# Altium schematic sheet Sheet1.SchDoc
size A4
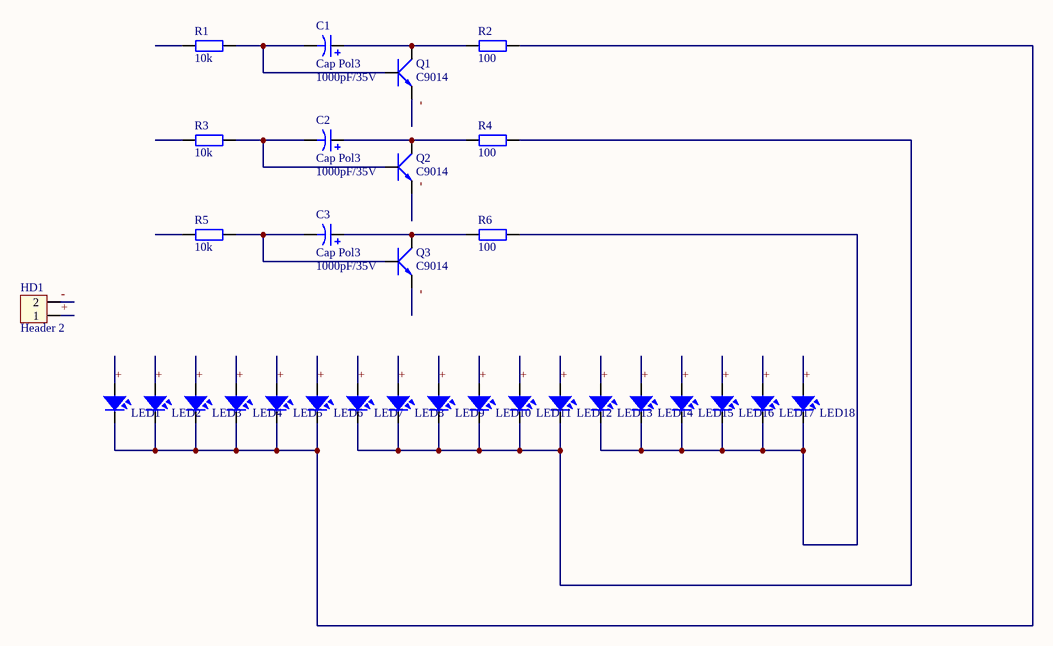
[diagram p0: Sheet1.SchDoc]

## Parts
C1  Cap Pol3  value 1000pF/35V  [CP2/5]
C2  Cap Pol3  value 1000pF/35V  [CP2/5]
C3  Cap Pol3  value 1000pF/35V  [CP2/5]
HD1  Header 2  [HED2B]
LED1  LED  [LED-5-RED]  (value not drawn)
LED2  LED  [LED-5-RED]  (value not drawn)
LED3  LED  [LED-5-RED]  (value not drawn)
LED4  LED  [LED-5-RED]  (value not drawn)
LED5  LED  [LED-5-RED]  (value not drawn)
LED6  LED  [LED-5-RED]  (value not drawn)
LED7  LED  [LED-5-RED]  (value not drawn)
LED8  LED  [LED-5-RED]  (value not drawn)
LED9  LED  [LED-5-RED]  (value not drawn)
LED10  LED  [LED-5-RED]  (value not drawn)
LED11  LED  [LED-5-RED]  (value not drawn)
LED12  LED  [LED-5-RED]  (value not drawn)
LED13  LED  [LED-5-RED]  (value not drawn)
LED14  LED  [LED-5-RED]  (value not drawn)
LED15  LED  [LED-5-RED]  (value not drawn)
LED16  LED  [LED-5-RED]  (value not drawn)
LED17  LED  [LED-5-RED]  (value not drawn)
LED18  LED  [LED-5-RED]  (value not drawn)
Q1  C9014  [QTO-92]
Q2  C9014  [QTO-92]
Q3  C9014  [QTO-92]
R1  10k  [R1/4W]
R2  100  [R1/4W]
R3  10k  [R1/4W]
R4  100  [R1/4W]
R5  10k  [R1/4W]
R6  100  [R1/4W]

## Nets
+: HD1.1 LED1.1 LED2.1 LED3.1 LED4.1 LED5.1 LED6.1 LED7.1 LED8.1 LED9.1 LED10.1 LED11.1 LED12.1 LED13.1 LED14.1 LED15.1 LED16.1 LED17.1 LED18.1
-: HD1.2 Q1.1(E) Q3.1(E)
NetC1_1: C1.1 Q1.3(C) R2.2
NetC1_2: C1.2 Q1.2(B) R1.1
NetC2_1: C2.1 Q2.3(C) R4.2
NetC2_2: C2.2 Q2.2(B) R3.1
NetC3_1: C3.1 Q3.3(C) R6.2
NetC3_2: C3.2 Q3.2(B) R5.1
NetLED1_2: LED1.2 LED2.2 LED3.2 LED4.2 LED5.2 LED6.2 R2.1
NetLED7_2: LED7.2 LED8.2 LED9.2 LED10.2 LED11.2 LED12.2 R4.1
NetLED13_2: LED13.2 LED14.2 LED15.2 LED16.2 LED17.2 LED18.2 R6.1

Not connected (* = marked no-connect by the designer): Q2 1(E); R1 2; R3 2; R5 2

## Notes on the sheet
- Labels drawn without touching a wire or pin: -

## Library data of the parts
C1-C3 = Cap Pol3_1: Polarized Capacitor (Surface Mount); VALUE: C?; LatestRevisionDate: 17-Jul-2002; LatestRevisionNote: Re-released for DXP Platform.; PackageReference: C0805; Publisher: Altium Limited
HD1 = Hed2: Header 2 (Green); Value: Header 2
LED1-LED18 = LED: LED Single colour Green and Red; Value: LED 3 ly Single Colour
Q1-Q3 = C9014: PNP 600mW, EBC; Value: C9014
R1-R6 = R1/4W: Resistor 1/4W; Value: R1/4W - 1K